# Altium project Stairs LED.PrjPcb
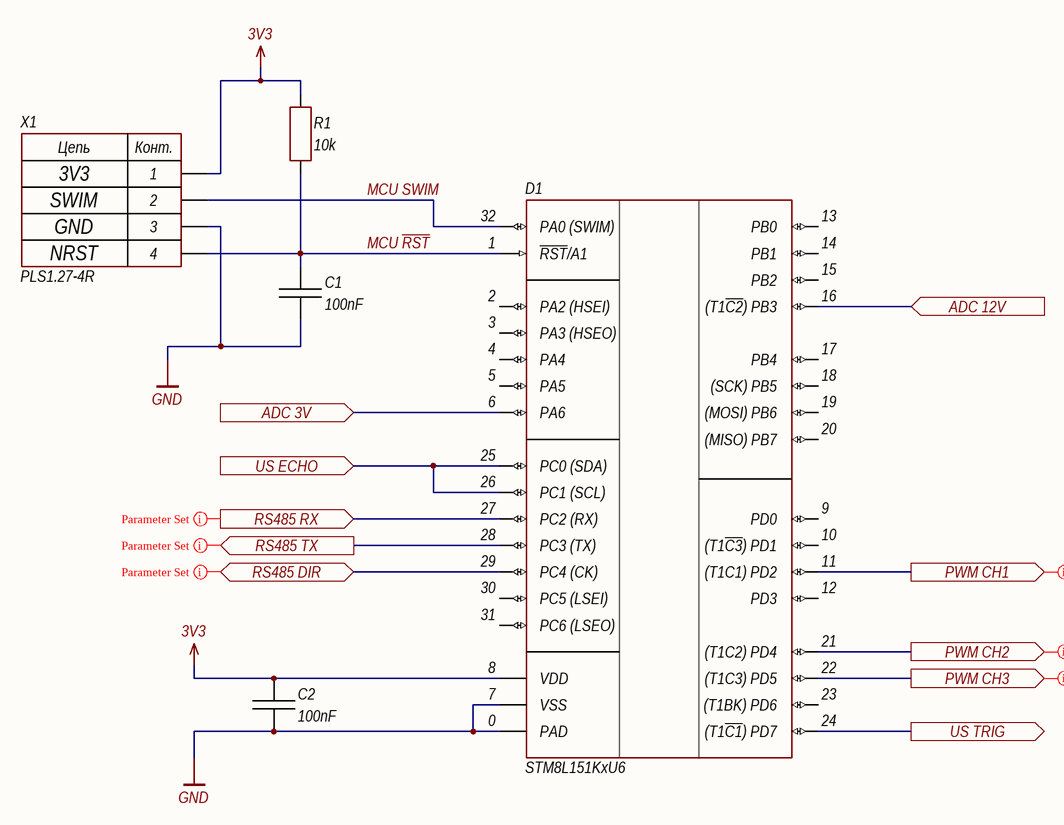
[diagram p0: MCU.SchDoc]
ProjectAuthor: Clark A.; ProjectCompanyName: Azek Clark © 2020; ProjectDate: 29.10.2020; ProjectNumber: StairsLED; ProjectRevision: 003; ProjectShortDate: 2020.10; ProjectTitle: RGB LED strip controller with Ultrasonic sensor
5 sheets, 34 parts. Net scope: flat (ports and power ports of the same name join across sheets).
Sheets:
  MCU.SchDoc
  Board-RS485.SchDoc
  Board-PWM.SchDoc
  Board-PowerSupply.SchDoc
  Board-Ultrasonic.SchDoc

## Sheet MCU.SchDoc: =ProjectTitle
size 297 x 209 mm; Author: Clark A.; CompanyName: Azek Clark © 2020; Address1: Address1; Address2: Address2; Address3: Address3; Address4: Address4; DocumentNumber: StairsLED 003; SheetNumber: 1; SheetTotal: 6; Scale: 1:1; DocumentType: Схема электрическая принципиальная; FirstReferrence: StairsLED; Title2str: ?

### Parts
C1  100nF  [CH0402C]
C2  100nF  [CH0402C]
D1  STM8L151KxU6  [32-UFQFPN]
R1  10k  [CH0402R]
X1  PLS1.27-4R  [CON: PLS1.27-4R]

### Ports
ADC 3V (in), ADC 12V (in), PWM CH1 (out), PWM CH2 (out), PWM CH3 (out), RS485 DIR (bidir), RS485 RX (in), RS485 TX (out), US ECHO (in), US TRIG (out)

### Nets
3V3: C2.2 D1.8(VDD) R1.2 X1.1
GND: C1.1 C2.1 D1.0(PAD) D1.7(VSS) X1.3
ADC 3V: D1.6(PA6) ; port ADC 3V
ADC 12V: D1.16((T1~{C2})_PB3) ; port ADC 12V
MCU ~{RST}: C1.2 D1.1(~{RST}/A1) R1.1 X1.4
MCU SWIM: D1.32(PA0_(SWIM)) X1.2
PWM CH1: D1.11((T1C1)_PD2) ; port PWM CH1
PWM CH2: D1.21((T1C2)_PD4) ; port PWM CH2
PWM CH3: D1.22((T1C3)_PD5) ; port PWM CH3
RS485 DIR: D1.29(PC4_(CK)) ; port RS485 DIR
RS485 RX: D1.27(PC2_(RX)) ; port RS485 RX
RS485 TX: D1.28(PC3_(TX)) ; port RS485 TX
US ECHO: D1.25(PC0_(SDA)) D1.26(PC1_(SCL)) ; port US ECHO
US TRIG: D1.24((T1~{C1})_PD7) ; port US TRIG

Not connected (* = marked no-connect by the designer): D1 2(PA2_(HSEI)) 3(PA3_(HSEO)) 4(PA4) 5(PA5) 9(PD0) 10((T1~{C3})_PD1) 12(PD3) 13(PB0) 14(PB1) 15(PB2) 17(PB4) 18((SCK)_PB5) 19((MOSI)_PB6) 20((MISO)_PB7) 23((T1BK)_PD6) 30(PC5_(LSEI)) 31(PC6_(LSEO))

### Layout directives
net class RS485 UART; rule Matched Net Lengths [Tolerance = 0.1mm]: RS485 DIR, RS485 RX, RS485 TX
net class PWM LED; rule Matched Net Lengths [Tolerance = 0.1mm]: PWM CH1, PWM CH2, PWM CH3

### Notes on the sheet
- 3V3
- GND
- SWIM
- NRST
- Утв.
- Н.контр.
- Т.контр.
- Пров.
- Разраб.
- Изм.
- Лист
- № докум.
- Подп.
- Дата
- Копировал
- Формат А4
- Лит.
- Листов
- Масса
- Масштаб

### Library data of the parts
C1 C2 = Capacitor: Manufacturer: CCTC; Model: TCC0402X7R104K250AT; HelpURL: https://lcsc.com/product-detail/Multilayer-Ceramic-Capacitors-MLCC-SMD-SMT_CCTC-TCC0402X7R104K250AT_C466234.html; ComponentKind: X7R, 50V; Value: 100nF
D1 = STM8L151KxU6: STM8; Manufacturer: ST Microelectronics; Model: STM8L151K4U6; ComponentKind: 1.8-3.6V, UFQFPN32; HelpURL: https://ru.mouser.com/datasheet/2/389/stm8l151c4-956418.pdf
R1 = Resistor: Manufacturer: Uniroyal Elec; Model: 0402WGF1002TCE; HelpURL: https://lcsc.com/product-detail/Chip-Resistor-Surface-Mount_UNI-ROYAL-Uniroyal-Elec-0402WGF1002TCE_C25744.html; ComponentKind: ±1%; Value: 10k
X1 = 4-Connector: Model: PLS1.27-4R; Manufacturer: *; HelpURL: *; ComponentKind: *

## Sheet Board-RS485.SchDoc: =ProjectTitle
size 297 x 209 mm; Author: Clark A.; CompanyName: Azek Clark © 2020; Address1: Address1; Address2: Address2; Address3: Address3; Address4: Address4; DocumentNumber: StairsLED 003; SheetNumber: 2; SheetTotal: 6; Scale: 1:1; DocumentType: Схема электрическая принципиальная; FirstReferrence: StairsLED
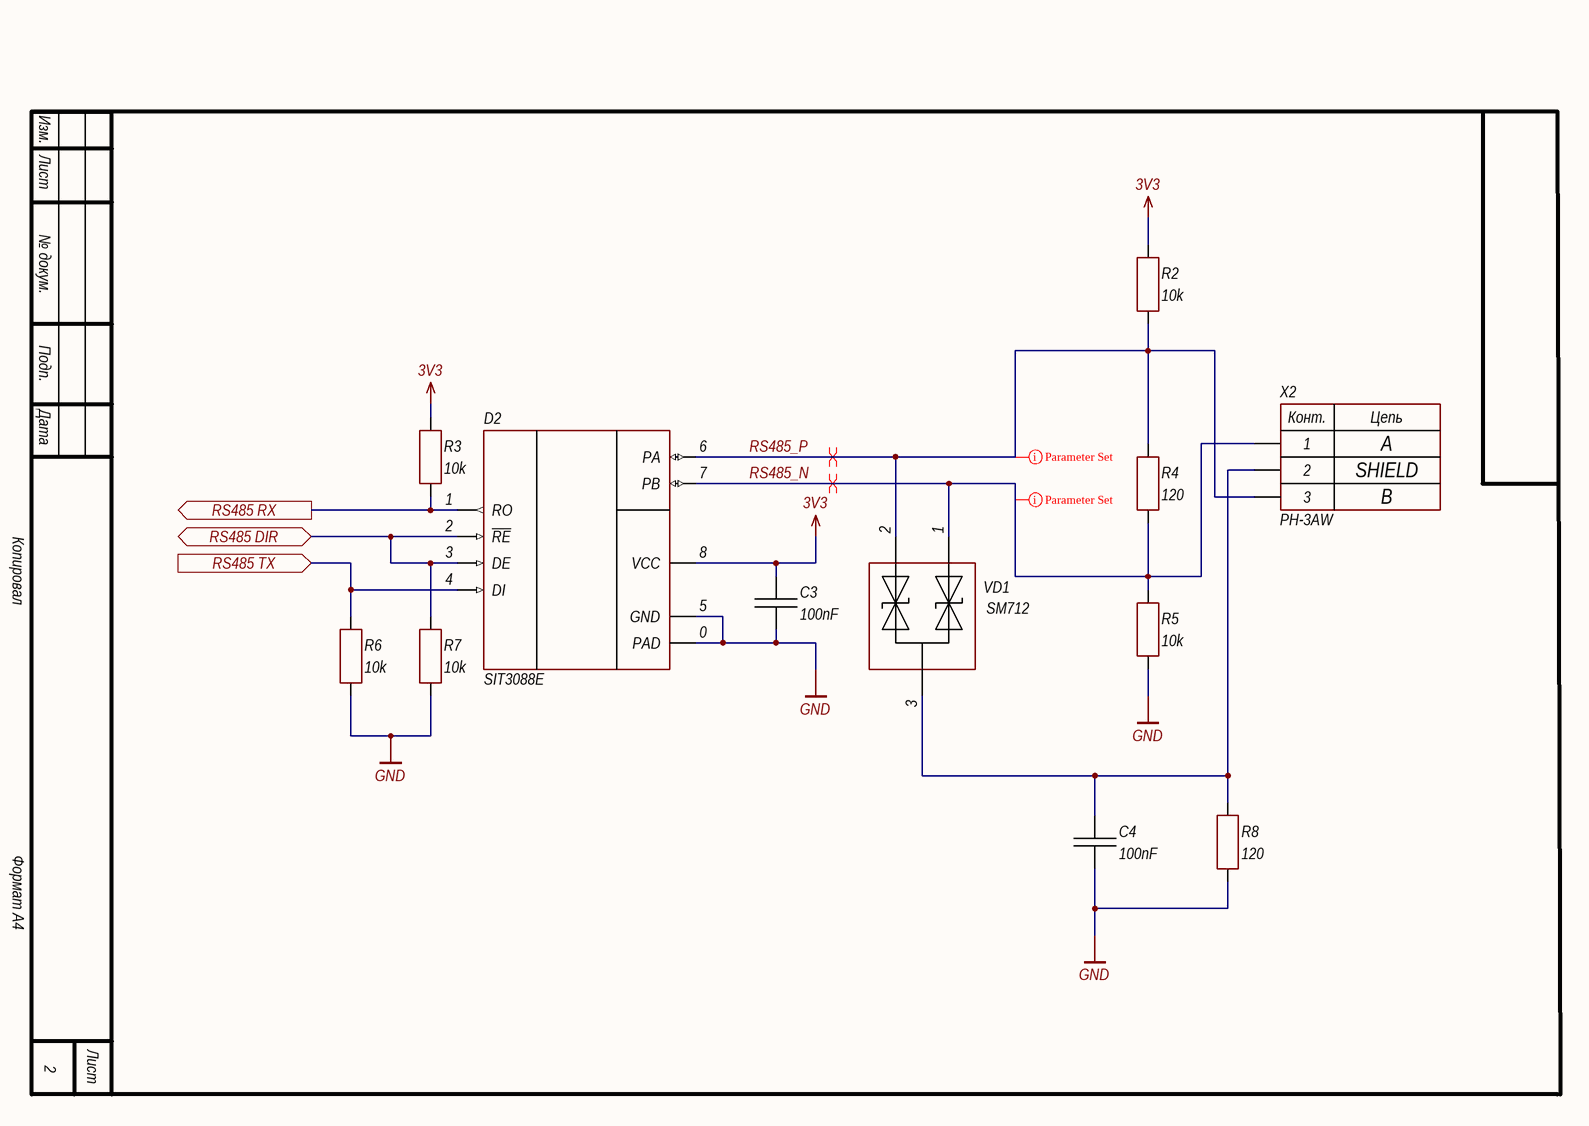
[diagram p1: Board-RS485.SchDoc]

### Parts
C3  100nF  [CH0402C]
C4  100nF  [CH0402C]
D2  SIT3088E  [8-DFN (3x3 mm, 0.65mm pitch)]
R2  10k  [CH0402R]
R3  10k  [CH0402R]
R4  120  [CH0402R]
R5  10k  [CH0402R]
R6  10k  [CH0402R]
R7  10k  [CH0402R]
R8  120  [CH0402R]
VD1  SM712  [SOT23_132]
X2  PH-3AW  [CON: PH-3AW]

### Ports
RS485 DIR (bidir), RS485 RX (out), RS485 TX (in)

### Nets
3V3: C3.2 D2.8(VCC) R2.2 R3.2
GND: C3.1 C4.1 D2.0(PAD) D2.5(GND) R5.1 R6.1 R7.1 R8.1
RS485 DIR: D2.2(~{RE}) D2.3(DE) R7.2 ; port RS485 DIR
RS485 RX: D2.1(RO) R3.1 ; port RS485 RX
RS485 TX: D2.4(DI) R6.2 ; port RS485 TX
RS485_N: D2.7(PB) R4.1 R5.2 VD1.1 X2.1
RS485_P: D2.6(PA) R2.1 R4.2 VD1.2 X2.3
NetC4_2: C4.2 R8.2 VD1.3 X2.2

### Layout directives
differential pair: RS485_N, RS485_P
rule Matched Net Lengths [Tolerance = 0.05mm]; net class RS485: RS485_N, RS485_P

### Notes on the sheet
- SHIELD
- A
- B
- Изм.
- Лист
- № докум.
- Подп.
- Дата
- Копировал
- Формат А4
- (in symbol 3-Connector) Конт.; Цепь

### Library data of the parts
C3 C4 = Capacitor: as C1 on sheet MCU; HelpURL: https://lcsc.com/product-detail/Multilayer-Ceramic-Capacitors-MLCC-SMD-SMT_CCTC-TCC0402X7R104K250AT_C466234.html; ComponentKind: X7R, 50V; Value: 100nF
D2 = SIT3088E: RS485/RS422; Manufacturer: SIT; Model: SIT3088E; HelpURL: https://lcsc.com/product-detail/RS-485-RS-422-ICs_SIT-SIT3088ETK_C601076.html; ComponentKind: 3-5.5V, 1/8
R2 R3 R5-R7 = Resistor: as R1 on sheet MCU; HelpURL: https://lcsc.com/product-detail/Chip-Resistor-Surface-Mount_UNI-ROYAL-Uniroyal-Elec-0402WGF1002TCE_C25744.html; ComponentKind: ±1%; Value: 10k
R4 R8 = Resistor: Manufacturer: YAGEO; Model: RC0402FR-07120RL; HelpURL: https://lcsc.com/product-detail/Chip-Resistor-Surface-Mount_YAGEO-RC0402FR-07120RL_C114758.html; ComponentKind: ±1%; Value: 120
VD1 = TVS Array: Manufacturer: TECH PUBLIC; ComponentKind: 7V/12V, 150W; Model: SM712; HelpURL: https://lcsc.com/product-detail/TVS_TECH-PUBLIC-SM712_C521963.html
X2 = 3-Connector: Model: PH-3AW; Manufacturer: *; HelpURL: *; ComponentKind: *

## Sheet Board-PWM.SchDoc: =ProjectTitle
size 297 x 209 mm; Author: Clark A.; CompanyName: Azek Clark © 2020; Address1: Address1; Address2: Address2; Address3: Address3; Address4: Address4; DocumentNumber: StairsLED 003; SheetNumber: 3; SheetTotal: 6; Scale: 1:1; DocumentType: Схема электрическая принципиальная; FirstReferrence: StairsLED; Title2str: ?
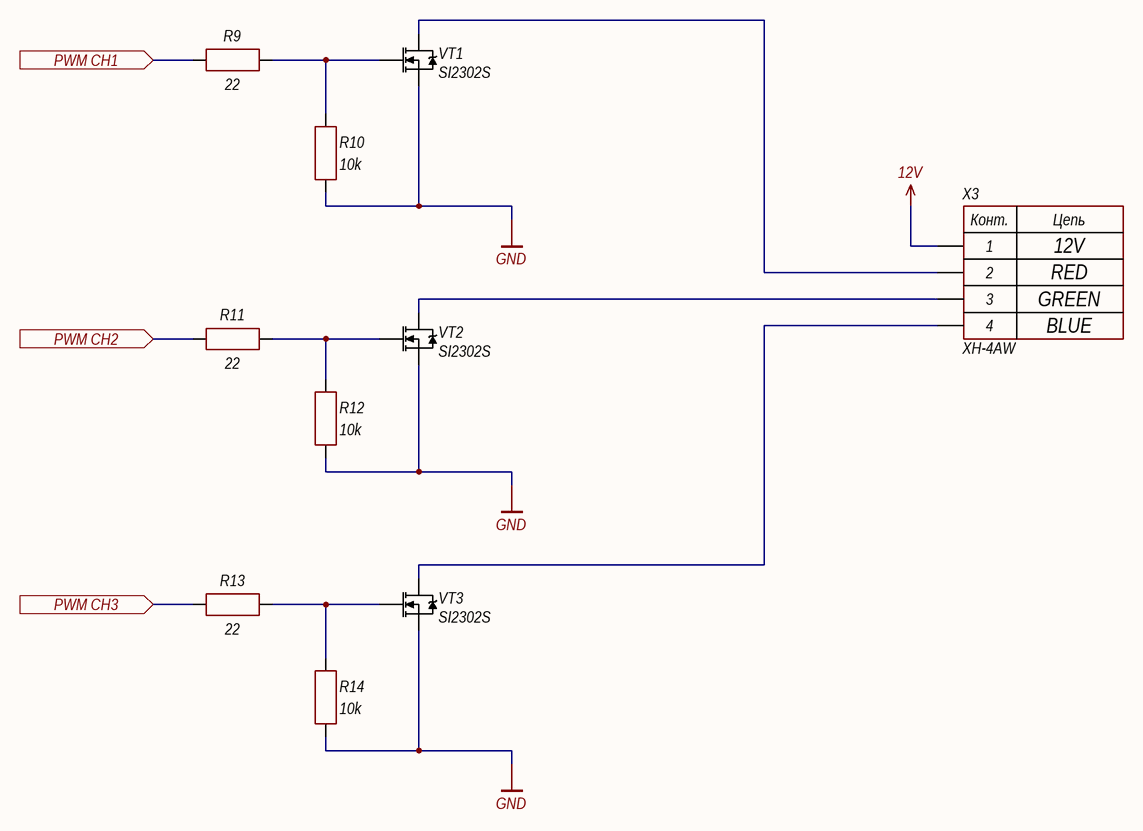
[diagram p2: Board-PWM.SchDoc]

### Parts
R9  22  [CH0402R]
R10  10k  [CH0402R]
R11  22  [CH0402R]
R12  10k  [CH0402R]
R13  22  [CH0402R]
R14  10k  [CH0402R]
VT1  SI2302S  [SOT23_123]
VT2  SI2302S  [SOT23_123]
VT3  SI2302S  [SOT23_123]
X3  XH-4AW  [CON: XH-4AW]

### Ports
PWM CH1 (in), PWM CH2 (in), PWM CH3 (in)

### Nets
12V: X3.1
GND: R10.1 R12.1 R14.1 VT1.3(S) VT2.3(S) VT3.3(S)
PWM CH1: R9.1 ; port PWM CH1
PWM CH2: R11.1 ; port PWM CH2
PWM CH3: R13.1 ; port PWM CH3
NetR9_2: R9.2 R10.2 VT1.1(G)
NetR11_2: R11.2 R12.2 VT2.1(G)
NetR13_2: R13.2 R14.2 VT3.1(G)
NetVT1_2: VT1.2(D) X3.2
NetVT2_2: VT2.2(D) X3.3
NetVT3_2: VT3.2(D) X3.4

### Notes on the sheet
- 12V
- RED
- GREEN
- BLUE
- Изм.
- Лист
- № докум.
- Подп.
- Дата
- Копировал
- Формат А4
- (in symbol 4-Connector) Конт.; Цепь

### Library data of the parts
R9 R11 R13 = Resistor: Manufacturer: YAGEO; Model: RC0402FR-0722RL; HelpURL: https://lcsc.com/product-detail/Chip-Resistor-Surface-Mount_22R-22R0-1_C114765.html; ComponentKind: ±1%; Value: 22
R10 R12 R14 = Resistor: as R1 on sheet MCU; HelpURL: https://lcsc.com/product-detail/Chip-Resistor-Surface-Mount_UNI-ROYAL-Uniroyal-Elec-0402WGF1002TCE_C25744.html; ComponentKind: ±1%; Value: 10k
VT1-VT3 = N-chanel: Mosfet; Manufacturer: Microdiode Electronics; Model: SI2302S; ComponentKind: 20V, 2.3A, 1.5V; HelpURL: https://lcsc.com/product-detail/MOSFET_MDD-Microdiode-Electronics-SI2302S_C427388.html
X3 = 4-Connector: Model: XH-4AW; Manufacturer: *; HelpURL: *; ComponentKind: *

## Sheet Board-PowerSupply.SchDoc: =ProjectTitle
size 297 x 209 mm; Author: Clark A.; CompanyName: Azek Clark © 2020; Address1: Address1; Address2: Address2; Address3: Address3; Address4: Address4; DocumentNumber: StairsLED 003; SheetNumber: 4; SheetTotal: 6; Scale: 1:1; DocumentType: Схема электрическая принципиальная; FirstReferrence: StairsLED
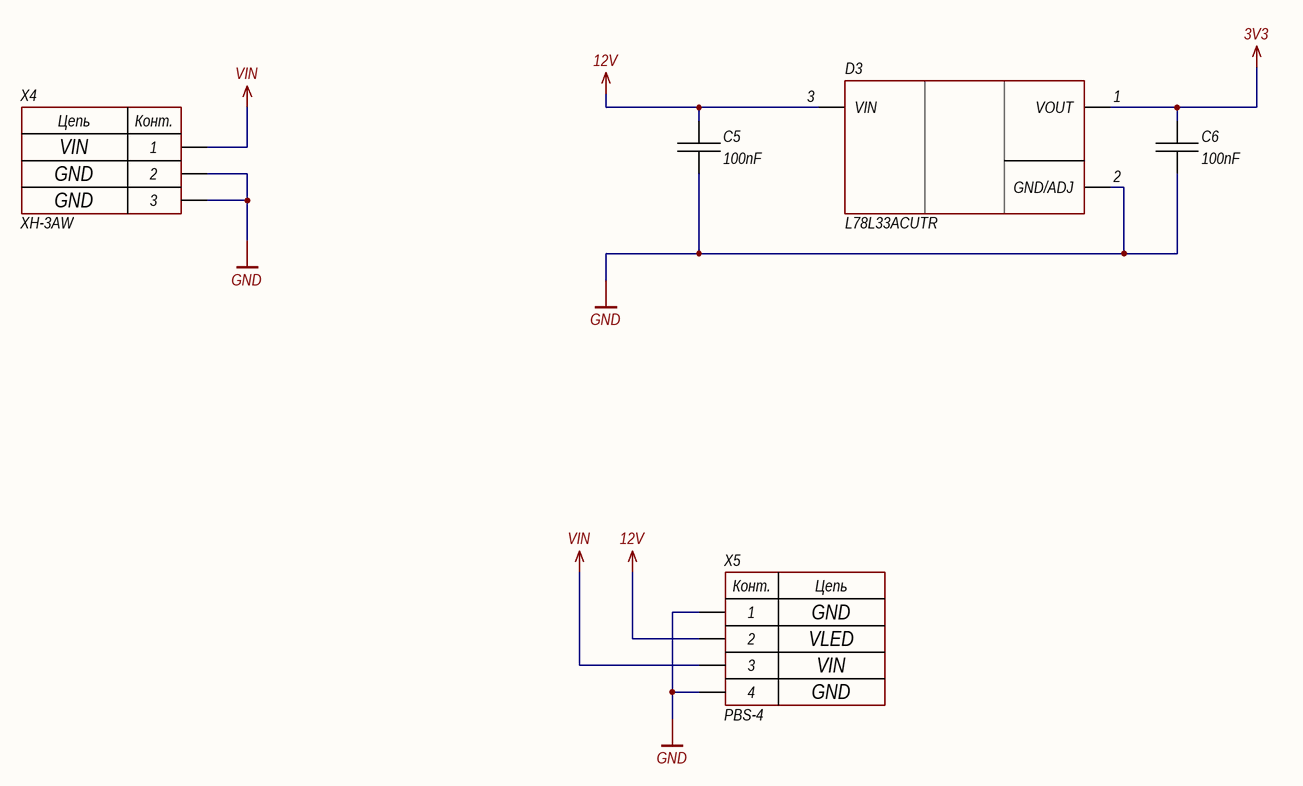
[diagram p3: Board-PowerSupply.SchDoc]

### Parts
C5  100nF  [CH0402C]
C6  100nF  [CH0402C]
D3  L78L33ACUTR  [SOT89_123]
X4  XH-3AW  [CON: XH-3AW]
X5  PBS-4  [CON: PBS-4]

### Nets
3V3: C6.2 D3.1(VOUT)
12V: C5.2 D3.3(VIN) X5.2
GND: C5.1 C6.1 D3.2(GND/ADJ) X4.2 X4.3 X5.1 X5.4
VIN: X4.1 X5.3

### Notes on the sheet
- VIN
- GND
- VLED
- Изм.
- Лист
- № докум.
- Подп.
- Дата
- Копировал
- Формат А4
- (in symbol 3-Connector) Цепь; Конт.
- (in symbol 4-Connector) Конт.; Цепь

### Library data of the parts
C5 C6 = Capacitor: as C1 on sheet MCU; HelpURL: https://lcsc.com/product-detail/Multilayer-Ceramic-Capacitors-MLCC-SMD-SMT_CCTC-TCC0402X7R104K250AT_C466234.html; ComponentKind: X7R, 50V; Value: 100nF
D3 = L78LxxACUTR: Step-down; Manufacturer: ST Microelectronics; Model: L78L33ACUTR; HelpURL: https://www.st.com/resource/en/datasheet/l78l.pdf; ComponentKind: SOT-89, 100mA
X4 = 3-Connector: Model: XH-3AW; Manufacturer: *; HelpURL: *; ComponentKind: *
X5 = 4-Connector: Model: PBS-4; Manufacturer: *; HelpURL: *; ComponentKind: *; System: Connector

## Sheet Board-Ultrasonic.SchDoc: =ProjectTitle
size 297 x 209 mm; Author: Clark A.; CompanyName: Azek Clark © 2020; Address1: Address1; Address2: Address2; Address3: Address3; Address4: Address4; DocumentNumber: StairsLED 003; SheetNumber: 5; SheetTotal: 6; Scale: 1:1; DocumentType: Схема электрическая принципиальная; FirstReferrence: StairsLED
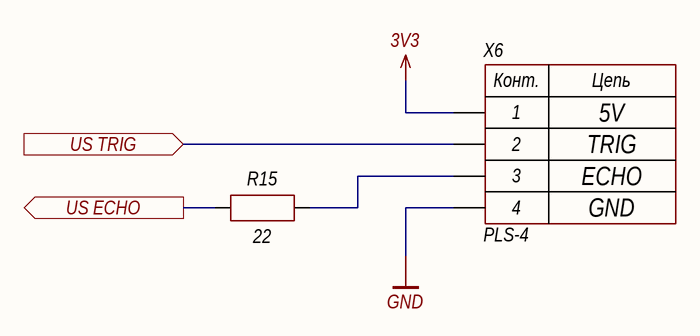
[diagram p4: Board-Ultrasonic.SchDoc]

### Parts
R15  22  [CH0402R]
X6  PLS-4  [CON: PLS-4]

### Ports
US ECHO (out), US TRIG (in)

### Nets
3V3: X6.1
GND: X6.4
US ECHO: R15.1 ; port US ECHO
US TRIG: X6.2 ; port US TRIG
NetR15_2: R15.2 X6.3

### Notes on the sheet
- 5V
- ECHO
- TRIG
- GND
- Изм.
- Лист
- № докум.
- Подп.
- Дата
- Копировал
- Формат А4
- (in symbol 4-Connector) Конт.; Цепь

### Library data of the parts
R15 = Resistor: as R9 on sheet Board-PWM; HelpURL: https://lcsc.com/product-detail/Chip-Resistor-Surface-Mount_22R-22R0-1_C114765.html; ComponentKind: ±1%; Value: 22
X6 = 4-Connector: Model: PLS-4; Manufacturer: *; HelpURL: *; ComponentKind: *

## Nets that join several sheets
3V3: MCU (C2.2 D1.8 R1.2 X1.1), Board-RS485 (C3.2 D2.8 R2.2 R3.2), Board-PowerSupply (C6.2 D3.1), Board-Ultrasonic (X6.1)
12V: Board-PWM (X3.1), Board-PowerSupply (C5.2 D3.3 X5.2)
GND: MCU (5 pins), Board-RS485 (8 pins), Board-PWM (6 pins), Board-PowerSupply (7 pins), Board-Ultrasonic (X6.4)
PWM CH1: MCU (D1.11), Board-PWM (R9.1)
PWM CH2: MCU (D1.21), Board-PWM (R11.1)
PWM CH3: MCU (D1.22), Board-PWM (R13.1)
RS485 DIR: MCU (D1.29), Board-RS485 (D2.2 D2.3 R7.2)
RS485 RX: MCU (D1.27), Board-RS485 (D2.1 R3.1)
RS485 TX: MCU (D1.28), Board-RS485 (D2.4 R6.2)
US ECHO: MCU (D1.25 D1.26), Board-Ultrasonic (R15.1)
US TRIG: MCU (D1.24), Board-Ultrasonic (X6.2)